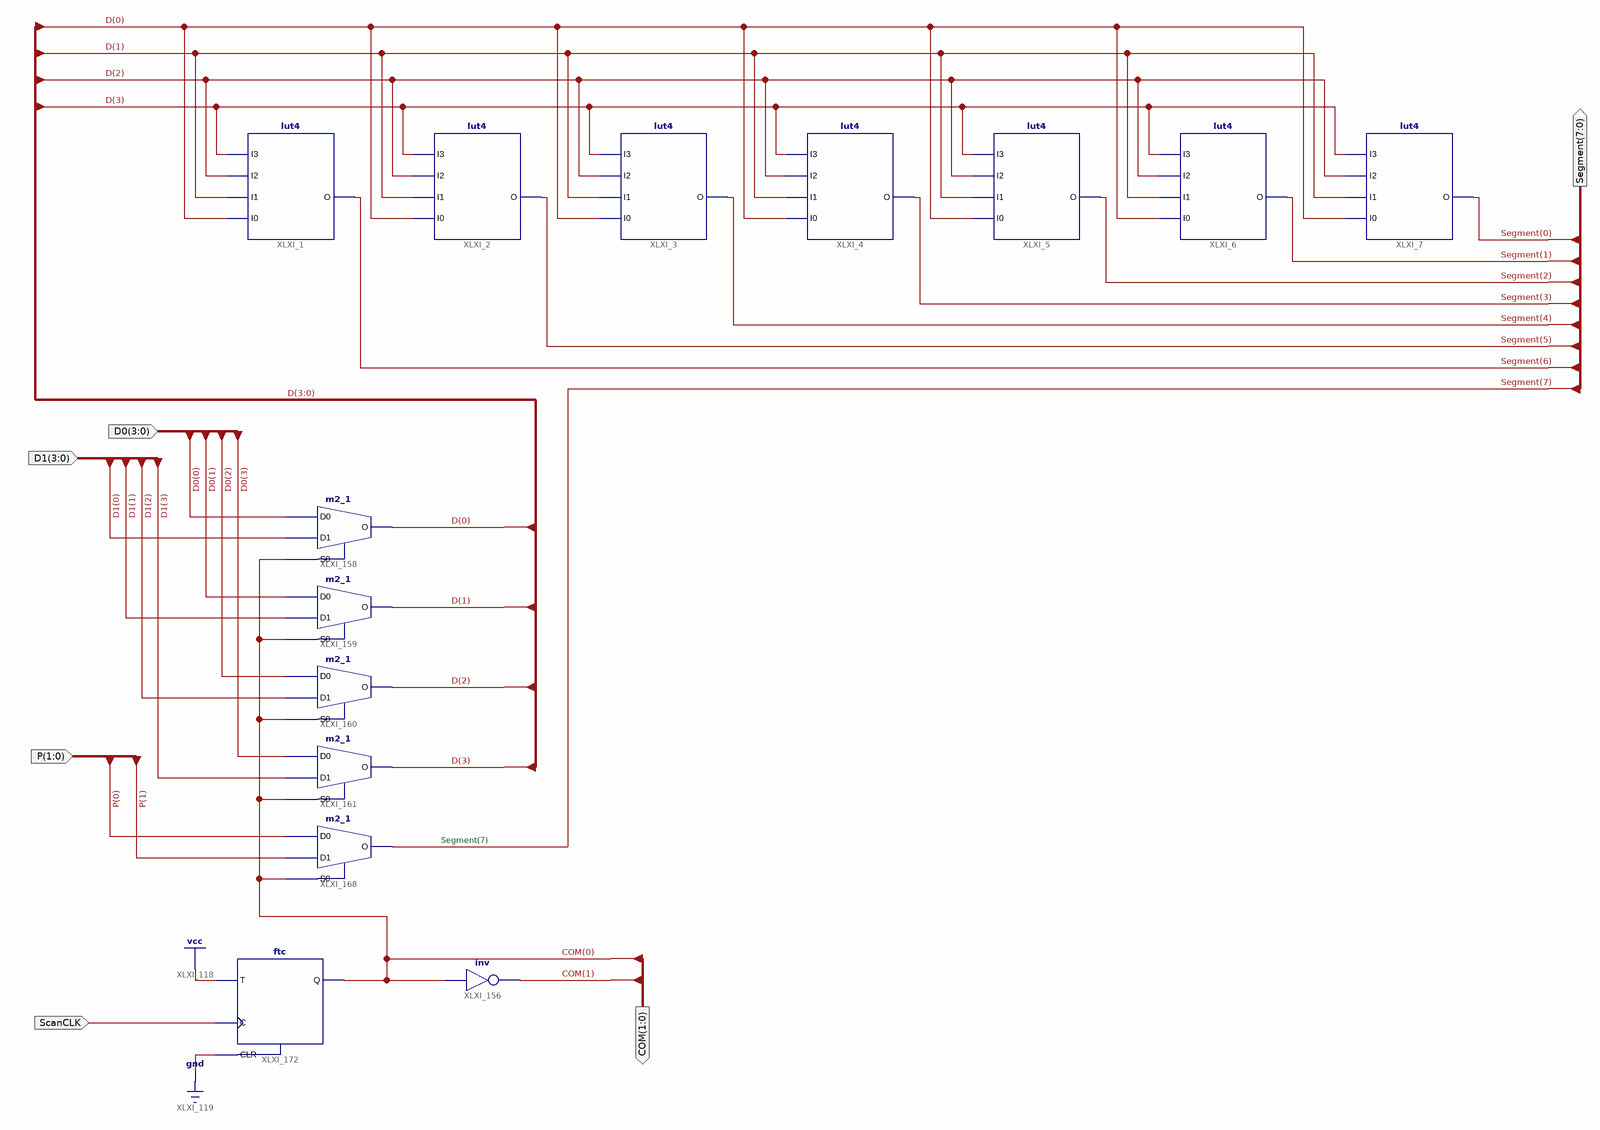
[diagram p0: schematic sheet 1]
// Xilinx ISE schematic ssd2d0ftpb.sch (spartan6) as structural Verilog: 14 symbols, 6 ports
module ssd2d0ftpb (
  input  [3:0] D1,
  input  [3:0] D0,
  input  [1:0] P,
  input  ScanCLK,
  output [7:0] Segment,
  output [1:0] COM
);

  wire [3:0] D;

  lut4 #(.INIT("EF7C")) XLXI_1 (.I0(D[0]), .I1(D[1]), .I2(D[2]), .I3(D[3]), .O(Segment[6]));
  lut4 #(.INIT("DF71")) XLXI_2 (.I0(D[0]), .I1(D[1]), .I2(D[2]), .I3(D[3]), .O(Segment[5]));
  lut4 #(.INIT("FD45")) XLXI_3 (.I0(D[0]), .I1(D[1]), .I2(D[2]), .I3(D[3]), .O(Segment[4]));
  lut4 #(.INIT("7B6D")) XLXI_4 (.I0(D[0]), .I1(D[1]), .I2(D[2]), .I3(D[3]), .O(Segment[3]));
  lut4 #(.INIT("2FFB")) XLXI_5 (.I0(D[0]), .I1(D[1]), .I2(D[2]), .I3(D[3]), .O(Segment[2]));
  lut4 #(.INIT("279F")) XLXI_6 (.I0(D[0]), .I1(D[1]), .I2(D[2]), .I3(D[3]), .O(Segment[1]));
  lut4 #(.INIT("D7ED")) XLXI_7 (.I0(D[0]), .I1(D[1]), .I2(D[2]), .I3(D[3]), .O(Segment[0]));
  m2_1 XLXI_158 (.D0(D0[0]), .D1(D1[0]), .S0(COM[0]), .O(D[0]));
  m2_1 XLXI_159 (.D0(D0[1]), .D1(D1[1]), .S0(COM[0]), .O(D[1]));
  m2_1 XLXI_160 (.D0(D0[2]), .D1(D1[2]), .S0(COM[0]), .O(D[2]));
  m2_1 XLXI_161 (.D0(D0[3]), .D1(D1[3]), .S0(COM[0]), .O(D[3]));
  m2_1 XLXI_168 (.D0(P[0]), .D1(P[1]), .S0(COM[0]), .O(Segment[7]));
  not XLXI_156 (COM[1], COM[0]);
  ftc XLXI_172 (.C(ScanCLK), .CLR(1'b0), .T(1'b1), .Q(COM[0]));

  // Notes on the sheet:
  //   Segment(7)
endmodule
